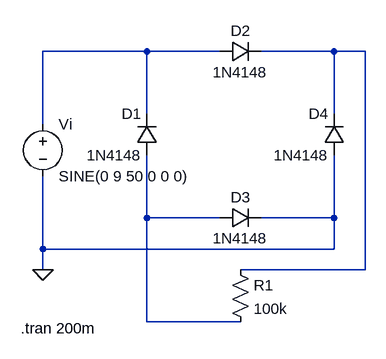
[diagram p0: schematic Lab3.asc]
Lab3.asc, the LTspice schematic file:
Version 4
SHEET 1 880 680
WIRE 96 0 -64 0
WIRE 208 0 96 0
WIRE 384 0 272 0
WIRE 432 0 384 0
WIRE 96 96 96 0
WIRE 384 96 384 0
WIRE -64 112 -64 0
WIRE 96 256 96 160
WIRE 208 256 96 256
WIRE 384 256 384 160
WIRE 384 256 272 256
WIRE -64 304 -64 192
WIRE 384 304 384 256
WIRE 384 304 -64 304
WIRE -64 336 -64 304
WIRE 432 336 432 0
WIRE 432 336 240 336
WIRE 96 416 96 256
WIRE 240 416 96 416
FLAG -64 336 0
SYMBOL diode 208 16 R270
WINDOW 0 32 32 VTop 2
WINDOW 3 0 32 VBottom 2
SYMATTR InstName D2
SYMATTR Value 1N4148
SYMBOL diode 112 160 R180
WINDOW 0 24 64 Left 2
WINDOW 3 24 0 Left 2
SYMATTR InstName D1
SYMATTR Value 1N4148
SYMBOL diode 400 160 R180
WINDOW 0 24 64 Left 2
WINDOW 3 24 0 Left 2
SYMATTR InstName D4
SYMATTR Value 1N4148
SYMBOL diode 208 272 R270
WINDOW 0 32 32 VTop 2
WINDOW 3 0 32 VBottom 2
SYMATTR InstName D3
SYMATTR Value 1N4148
SYMBOL res 224 320 R0
SYMATTR InstName R1
SYMATTR Value 100k
SYMBOL voltage -64 96 R0
WINDOW 123 0 0 Left 0
WINDOW 39 0 0 Left 0
SYMATTR InstName Vi
SYMATTR Value SINE(0 9 50 0 0 0)
TEXT -98 426 Left 2 !.tran 200m

The netlist it stands for:
* Lab3.asc
D2 N001 N002 1N4148
D1 N003 N001 1N4148
D4 0 N002 1N4148
D3 N003 0 1N4148
R1 N002 N003 100k
Vi N001 0 SINE(0 9 50 0 0 0)
.model D D
.lib standard.dio
.tran 200m
.backanno
.end